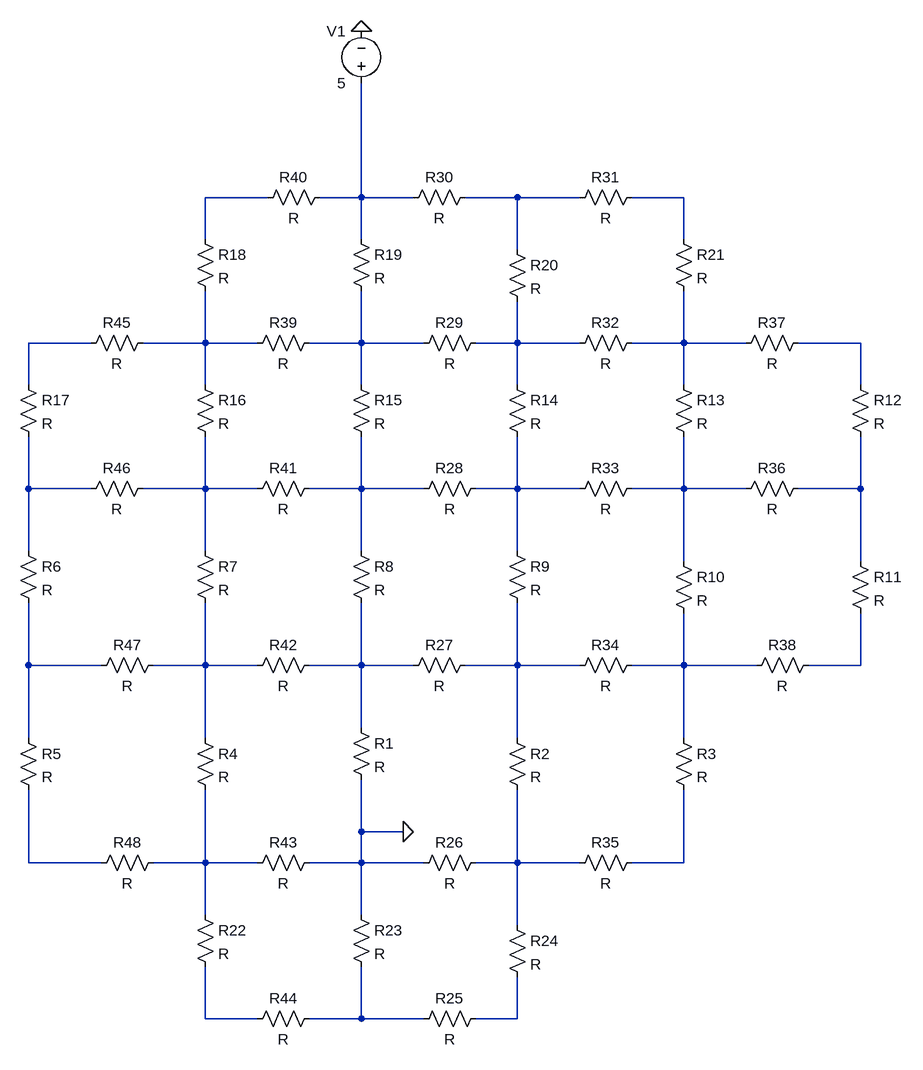
[diagram p0: schematic Draft1.asc]
Draft1.asc, the LTspice schematic file:
Version 4
SHEET 1 1060 1456
WIRE 80 144 -16 144
WIRE 224 144 224 -32
WIRE 224 144 160 144
WIRE 304 144 224 144
WIRE 464 144 384 144
WIRE 560 144 464 144
WIRE 720 144 640 144
WIRE -16 208 -16 144
WIRE 224 208 224 144
WIRE 720 208 720 144
WIRE 464 224 464 144
WIRE -192 368 -288 368
WIRE -16 368 -16 288
WIRE -16 368 -112 368
WIRE 64 368 -16 368
WIRE 224 368 224 288
WIRE 224 368 144 368
WIRE 320 368 224 368
WIRE 464 368 464 304
WIRE 464 368 400 368
WIRE 560 368 464 368
WIRE 720 368 720 288
WIRE 720 368 640 368
WIRE 816 368 720 368
WIRE 992 368 896 368
WIRE -288 432 -288 368
WIRE -16 432 -16 368
WIRE 224 432 224 368
WIRE 464 432 464 368
WIRE 720 432 720 368
WIRE 992 432 992 368
WIRE -288 592 -288 512
WIRE -192 592 -288 592
WIRE -16 592 -16 512
WIRE -16 592 -112 592
WIRE 64 592 -16 592
WIRE 224 592 224 512
WIRE 224 592 144 592
WIRE 320 592 224 592
WIRE 464 592 464 512
WIRE 464 592 400 592
WIRE 560 592 464 592
WIRE 720 592 720 512
WIRE 720 592 640 592
WIRE 816 592 720 592
WIRE 992 592 992 512
WIRE 992 592 896 592
WIRE -288 688 -288 592
WIRE -16 688 -16 592
WIRE 224 688 224 592
WIRE 464 688 464 592
WIRE 720 704 720 592
WIRE 992 704 992 592
WIRE -288 864 -288 768
WIRE -176 864 -288 864
WIRE -16 864 -16 768
WIRE -16 864 -96 864
WIRE 64 864 -16 864
WIRE 224 864 224 768
WIRE 224 864 144 864
WIRE 304 864 224 864
WIRE 464 864 464 768
WIRE 464 864 384 864
WIRE 560 864 464 864
WIRE 720 864 720 784
WIRE 720 864 640 864
WIRE 832 864 720 864
WIRE 992 864 992 784
WIRE 992 864 912 864
WIRE 224 960 224 864
WIRE -288 976 -288 864
WIRE -16 976 -16 864
WIRE 464 976 464 864
WIRE 720 976 720 864
WIRE 224 1120 224 1040
WIRE 288 1120 224 1120
WIRE -288 1168 -288 1056
WIRE -176 1168 -288 1168
WIRE -16 1168 -16 1056
WIRE -16 1168 -96 1168
WIRE 64 1168 -16 1168
WIRE 224 1168 224 1120
WIRE 224 1168 144 1168
WIRE 320 1168 224 1168
WIRE 464 1168 464 1056
WIRE 464 1168 400 1168
WIRE 560 1168 464 1168
WIRE 720 1168 720 1056
WIRE 720 1168 640 1168
WIRE -16 1248 -16 1168
WIRE 224 1248 224 1168
WIRE 464 1264 464 1168
WIRE -16 1408 -16 1328
WIRE 64 1408 -16 1408
WIRE 224 1408 224 1328
WIRE 224 1408 144 1408
WIRE 320 1408 224 1408
WIRE 464 1408 464 1344
WIRE 464 1408 400 1408
FLAG 224 -112 0
FLAG 288 1120 0
SYMBOL voltage 224 -16 R180
WINDOW 0 24 96 Left 2
WINDOW 3 24 16 Left 2
WINDOW 123 0 0 Left 0
WINDOW 39 0 0 Left 0
SYMATTR InstName V1
SYMATTR Value 5
SYMBOL res 208 944 R0
SYMATTR InstName R1
SYMBOL res 448 960 R0
SYMATTR InstName R2
SYMBOL res 704 960 R0
SYMATTR InstName R3
SYMBOL res -32 960 R0
SYMATTR InstName R4
SYMBOL res -304 960 R0
SYMATTR InstName R5
SYMBOL res -304 672 R0
SYMATTR InstName R6
SYMBOL res -32 672 R0
SYMATTR InstName R7
SYMBOL res 208 672 R0
SYMATTR InstName R8
SYMBOL res 448 672 R0
SYMATTR InstName R9
SYMBOL res 704 688 R0
SYMATTR InstName R10
SYMBOL res 976 688 R0
SYMATTR InstName R11
SYMBOL res 976 416 R0
SYMATTR InstName R12
SYMBOL res 704 416 R0
SYMATTR InstName R13
SYMBOL res 448 416 R0
SYMATTR InstName R14
SYMBOL res 208 416 R0
SYMATTR InstName R15
SYMBOL res -32 416 R0
SYMATTR InstName R16
SYMBOL res -304 416 R0
SYMATTR InstName R17
SYMBOL res -32 192 R0
SYMATTR InstName R18
SYMBOL res 208 192 R0
SYMATTR InstName R19
SYMBOL res 448 208 R0
SYMATTR InstName R20
SYMBOL res 704 192 R0
SYMATTR InstName R21
SYMBOL res -32 1232 R0
SYMATTR InstName R22
SYMBOL res 208 1232 R0
SYMATTR InstName R23
SYMBOL res 448 1248 R0
SYMATTR InstName R24
SYMBOL res 416 1392 R90
WINDOW 0 0 56 VBottom 2
WINDOW 3 32 56 VTop 2
SYMATTR InstName R25
SYMBOL res 416 1152 R90
WINDOW 0 0 56 VBottom 2
WINDOW 3 32 56 VTop 2
SYMATTR InstName R26
SYMBOL res 400 848 R90
WINDOW 0 0 56 VBottom 2
WINDOW 3 32 56 VTop 2
SYMATTR InstName R27
SYMBOL res 416 576 R90
WINDOW 0 0 56 VBottom 2
WINDOW 3 32 56 VTop 2
SYMATTR InstName R28
SYMBOL res 416 352 R90
WINDOW 0 0 56 VBottom 2
WINDOW 3 32 56 VTop 2
SYMATTR InstName R29
SYMBOL res 400 128 R90
WINDOW 0 0 56 VBottom 2
WINDOW 3 32 56 VTop 2
SYMATTR InstName R30
SYMBOL res 656 128 R90
WINDOW 0 0 56 VBottom 2
WINDOW 3 32 56 VTop 2
SYMATTR InstName R31
SYMBOL res 656 352 R90
WINDOW 0 0 56 VBottom 2
WINDOW 3 32 56 VTop 2
SYMATTR InstName R32
SYMBOL res 656 576 R90
WINDOW 0 0 56 VBottom 2
WINDOW 3 32 56 VTop 2
SYMATTR InstName R33
SYMBOL res 656 848 R90
WINDOW 0 0 56 VBottom 2
WINDOW 3 32 56 VTop 2
SYMATTR InstName R34
SYMBOL res 656 1152 R90
WINDOW 0 0 56 VBottom 2
WINDOW 3 32 56 VTop 2
SYMATTR InstName R35
SYMBOL res 912 576 R90
WINDOW 0 0 56 VBottom 2
WINDOW 3 32 56 VTop 2
SYMATTR InstName R36
SYMBOL res 912 352 R90
WINDOW 0 0 56 VBottom 2
WINDOW 3 32 56 VTop 2
SYMATTR InstName R37
SYMBOL res 928 848 R90
WINDOW 0 0 56 VBottom 2
WINDOW 3 32 56 VTop 2
SYMATTR InstName R38
SYMBOL res 160 352 R90
WINDOW 0 0 56 VBottom 2
WINDOW 3 32 56 VTop 2
SYMATTR InstName R39
SYMBOL res 176 128 R90
WINDOW 0 0 56 VBottom 2
WINDOW 3 32 56 VTop 2
SYMATTR InstName R40
SYMBOL res 160 576 R90
WINDOW 0 0 56 VBottom 2
WINDOW 3 32 56 VTop 2
SYMATTR InstName R41
SYMBOL res 160 848 R90
WINDOW 0 0 56 VBottom 2
WINDOW 3 32 56 VTop 2
SYMATTR InstName R42
SYMBOL res 160 1152 R90
WINDOW 0 0 56 VBottom 2
WINDOW 3 32 56 VTop 2
SYMATTR InstName R43
SYMBOL res 160 1392 R90
WINDOW 0 0 56 VBottom 2
WINDOW 3 32 56 VTop 2
SYMATTR InstName R44
SYMBOL res -96 352 R90
WINDOW 0 0 56 VBottom 2
WINDOW 3 32 56 VTop 2
SYMATTR InstName R45
SYMBOL res -96 576 R90
WINDOW 0 0 56 VBottom 2
WINDOW 3 32 56 VTop 2
SYMATTR InstName R46
SYMBOL res -80 848 R90
WINDOW 0 0 56 VBottom 2
WINDOW 3 32 56 VTop 2
SYMATTR InstName R47
SYMBOL res -80 1152 R90
WINDOW 0 0 56 VBottom 2
WINDOW 3 32 56 VTop 2
SYMATTR InstName R48

The netlist it stands for:
* Draft1.asc
V1 N002 0 5
R1 N019 0 R
R2 N020 N025 R
R3 N021 N026 R
R4 N018 N024 R
R5 N017 N023 R
R6 N011 N017 R
R7 N012 N018 R
R8 N013 N019 R
R9 N014 N020 R
R10 N015 N021 R
R11 N016 N022 R
R12 N010 N016 R
R13 N009 N015 R
R14 N008 N014 R
R15 N007 N013 R
R16 N006 N012 R
R17 N005 N011 R
R18 N001 N006 R
R19 N002 N007 R
R20 N003 N008 R
R21 N004 N009 R
R22 N024 N027 R
R23 0 N028 R
R24 N025 N029 R
R25 N029 N028 R
R26 N025 0 R
R27 N020 N019 R
R28 N014 N013 R
R29 N008 N007 R
R30 N003 N002 R
R31 N004 N003 R
R32 N009 N008 R
R33 N015 N014 R
R34 N021 N020 R
R35 N026 N025 R
R36 N016 N015 R
R37 N010 N009 R
R38 N022 N021 R
R39 N007 N006 R
R40 N002 N001 R
R41 N013 N012 R
R42 N019 N018 R
R43 0 N024 R
R44 N028 N027 R
R45 N006 N005 R
R46 N012 N011 R
R47 N018 N017 R
R48 N024 N023 R
.backanno
.end